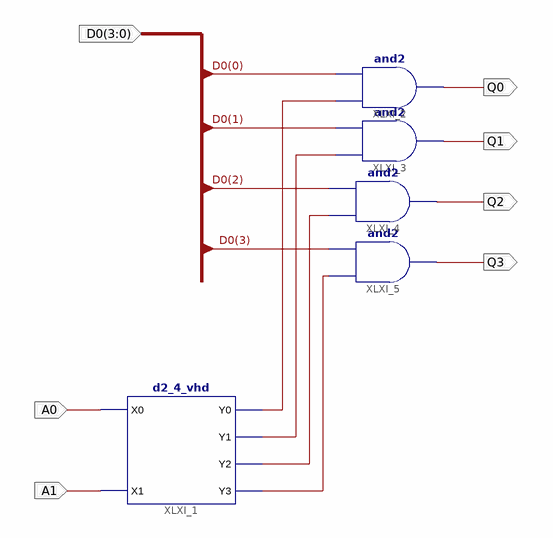
[diagram p0: schematic sheet 1]
// Xilinx ISE schematic demux_4b_1in.sch (spartan6) as structural Verilog: 5 symbols, 7 ports
module demux_4b_1in (
  input  [3:0] D0,
  input  A0,
  input  A1,
  output Q0,
  output Q1,
  output Q2,
  output Q3
);

  wire XLXN_7, XLXN_8, XLXN_9, XLXN_11;

  d2_4_vhd XLXI_1 (.X0(A0), .X1(A1), .Y0(XLXN_7), .Y1(XLXN_8), .Y2(XLXN_9), .Y3(XLXN_11));
  and XLXI_2 (Q0, XLXN_7, D0[0]);
  and XLXI_3 (Q1, XLXN_8, D0[1]);
  and XLXI_4 (Q2, XLXN_9, D0[2]);
  and XLXI_5 (Q3, XLXN_11, D0[3]);
endmodule
